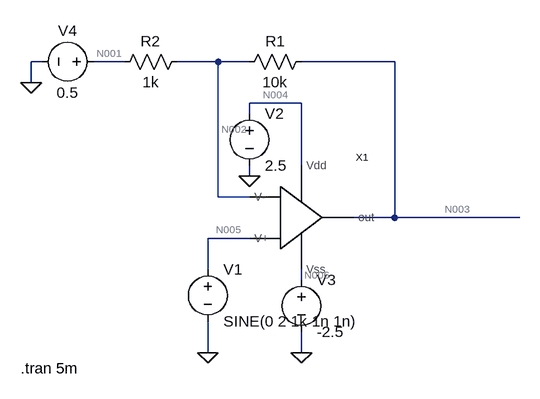
[diagram p0: schematic 4.asc]
4.asc, the LTspice schematic file:
Version 4
SHEET 1 880 680
WIRE -144 -48 -160 -48
WIRE -16 -48 -64 -48
WIRE 128 -48 64 -48
WIRE 176 -48 128 -48
WIRE 400 -48 256 -48
WIRE -160 -16 -160 -48
WIRE 256 16 176 16
WIRE 176 32 176 16
WIRE 256 112 256 16
WIRE 176 128 176 112
WIRE 128 160 128 -48
WIRE 176 160 128 160
WIRE 400 192 400 -48
WIRE 400 192 336 192
WIRE 592 192 400 192
WIRE 176 224 112 224
WIRE 112 272 112 224
WIRE 256 288 256 272
WIRE 112 400 112 352
WIRE 256 400 256 368
FLAG 112 400 0
FLAG 256 400 0
FLAG 176 128 0
FLAG -160 -16 0
SYMBOL res 272 -64 R90
WINDOW 0 0 56 VBottom 2
WINDOW 3 32 56 VTop 2
SYMATTR InstName R1
SYMATTR Value 10k
SYMBOL voltage 112 256 R0
WINDOW 123 0 0 Left 0
WINDOW 39 0 0 Left 0
SYMATTR InstName V1
SYMATTR Value SINE(0 2 1k 1n 1n)
SYMBOL voltage 176 16 R0
WINDOW 123 0 0 Left 0
WINDOW 39 0 0 Left 0
SYMATTR InstName V2
SYMATTR Value 2.5
SYMBOL voltage 256 272 R0
WINDOW 123 0 0 Left 0
WINDOW 39 0 0 Left 0
SYMATTR InstName V3
SYMATTR Value -2.5
SYMBOL res 80 -64 R90
WINDOW 0 0 56 VBottom 2
WINDOW 3 32 56 VTop 2
SYMATTR InstName R2
SYMATTR Value 1k
SYMBOL OPAMP 144 192 R0
SYMATTR InstName X1
SYMBOL voltage -48 -48 R90
WINDOW 0 -32 56 VBottom 2
WINDOW 3 32 56 VTop 2
WINDOW 123 0 0 Left 0
WINDOW 39 0 0 Left 0
SYMATTR InstName V4
SYMATTR Value 0.5
TEXT -176 424 Left 2 !.tran 5m

The netlist it stands for:
* 4.asc
R1 N003 N002 10k
V1 N005 0 SINE(0 2 1k 1n 1n)
V2 N004 0 2.5
V3 N006 0 -2.5
R2 N002 N001 1k
XX1 N004 N006 N002 N005 N003 OPAMP  ; pins Vdd Vss V- V+ out
V4 N001 0 0.5
.tran 5m
.backanno
.end

* Results of the author's LTspice run, read from the files saved beside the schematic
* Operating Point, zero values left out:
*   V(n003) = -862.9 mV
*   V(n002) = 376.1 mV
*   V(n004) = 2.5 V
*   V(n006) = -2.5 V
*   V(n001) = 500 mV
*   I(R1) = -123.9 µA
*   I(R2) = -123.9 µA
*   I(V2) = -60.82 µA
*   I(V3) = 184.7 µA
*   I(V4) = -123.9 µA
*   Ix(x1:VDD) = 60.82 µA
*   Ix(x1:VSS) = -184.7 µA
*   Ix(x1:OUT) = 123.9 µA
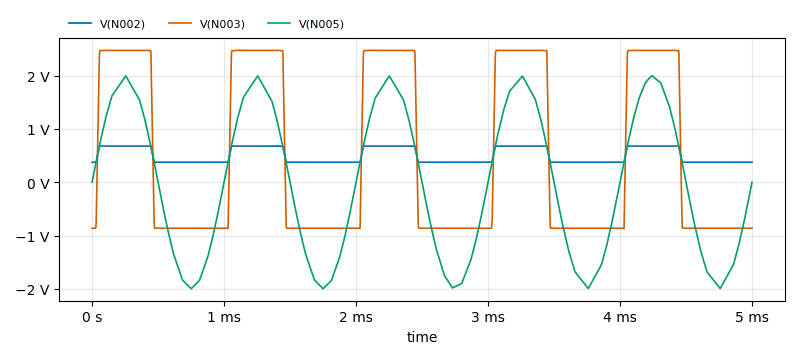
[diagram p1: Transient Analysis of 4.asc, plotted from the saved traces]
* Transient Analysis, 1 run:
*   V(N002): min 375.5 mV, max 679.6 mV, average 502 mV, rms 523.1 mV, last 376.1 mV
*   V(N003): min -869.1 mV, max 2.476 V, average 522 mV, rms 1.698 V, last -862.9 mV
*   V(N005): min -2 V, max 1.998 V, average -3.519 mV, rms 1.392 V, last -12.57 µV